# EAGLE design PicoBreakout (EAGLE 9.6.2)
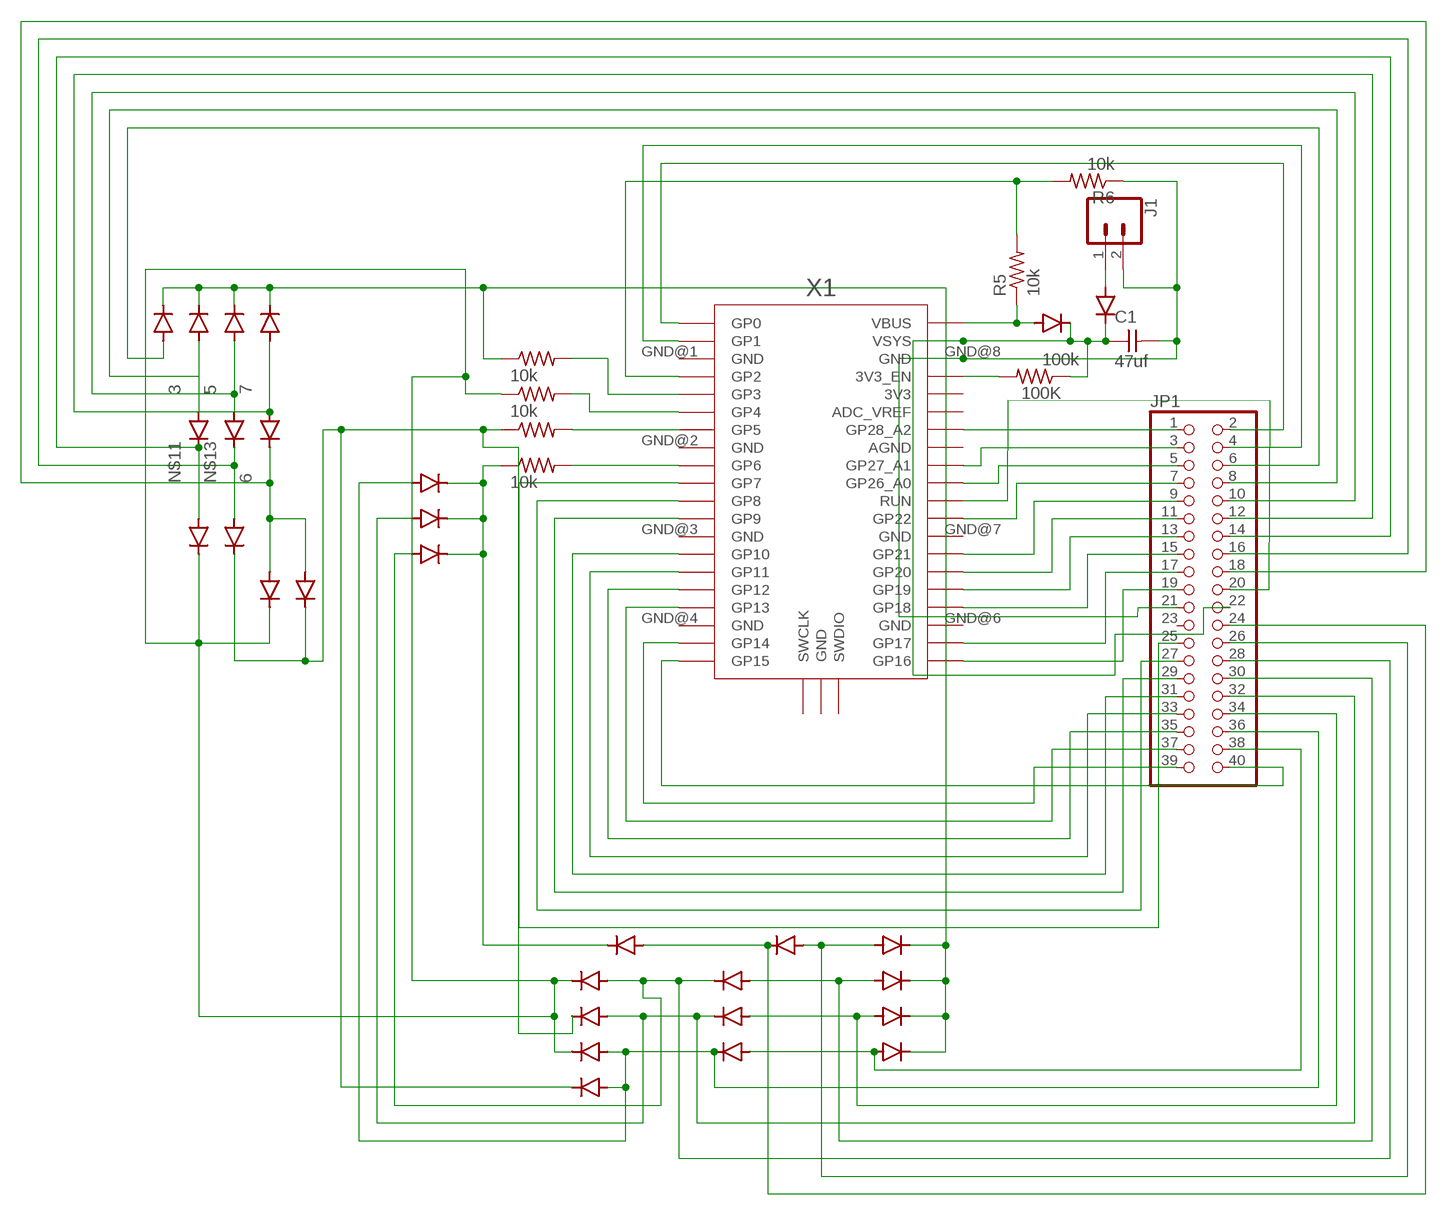
[diagram p0: schematic, sheet 1]

## Parts
100K  100k  R1206FAB  [R1206FAB]
C1  47uf  CAP_UNPOLARIZEDFAB  [C1206FAB]
D1  SCHOTTKY  DIODE_SCHOTTKY_CDBM1100-G  [MINI-SMA]
D2  SCHOTTKY  DIODE_SCHOTTKY_CDBM1100-G  [MINI-SMA]
D3  SCHOTTKY  DIODE_SCHOTTKY_CDBM1100-G  [MINI-SMA]
D4  SCHOTTKY  DIODE_SCHOTTKY_CDBM1100-G  [MINI-SMA]
D5  SCHOTTKY  DIODE_SCHOTTKY_CDBM1100-G  [MINI-SMA]
D6  SCHOTTKY  DIODE_SCHOTTKY_CDBM1100-G  [MINI-SMA]
D7  SCHOTTKY  DIODE_SCHOTTKY_CDBM1100-G  [MINI-SMA]
D8  SCHOTTKY  DIODE_SCHOTTKY_CDBM1100-G  [MINI-SMA]
D9  SCHOTTKY  DIODE_SCHOTTKY_CDBM1100-G  [MINI-SMA]
D10  SCHOTTKY  DIODE_SCHOTTKY_CDBM1100-G  [MINI-SMA]
D11  SCHOTTKY  DIODE_SCHOTTKY_CDBM1100-G  [MINI-SMA]
D12  SCHOTTKY  DIODE_SCHOTTKY_CDBM1100-G  [MINI-SMA]
D13  SCHOTTKY  DIODE_SCHOTTKY_CDBM1100-G  [MINI-SMA]
D14  SCHOTTKY  DIODE_SCHOTTKY_CDBM1100-G  [MINI-SMA]
D15  SCHOTTKY  DIODE_SCHOTTKY_CDBM1100-G  [MINI-SMA]
D16  SCHOTTKY  DIODE_SCHOTTKY_CDBM1100-G  [MINI-SMA]
D17  SCHOTTKY  DIODE_SCHOTTKY_CDBM1100-G  [MINI-SMA]
D18  SCHOTTKY  DIODE_SCHOTTKY_CDBM1100-G  [MINI-SMA]
D19  SCHOTTKY  DIODE_SCHOTTKY_CDBM1100-G  [MINI-SMA]
D20  SCHOTTKY  DIODE_SCHOTTKY_CDBM1100-G  [MINI-SMA]
D21  SCHOTTKY  DIODE_SCHOTTKY_CDBM1100-G  [MINI-SMA]
D22  SCHOTTKY  DIODE_SCHOTTKY_CDBM1100-G  [MINI-SMA]
D23  SCHOTTKY  DIODE_SCHOTTKY_CDBM1100-G  [MINI-SMA]
D24  SCHOTTKY  DIODE_SCHOTTKY_CDBM1100-G  [MINI-SMA]
D25  SCHOTTKY  DIODE_SCHOTTKY_CDBM1100-G  [MINI-SMA]
D26  SCHOTTKY  DIODE_SCHOTTKY_CDBM1100-G  [MINI-SMA]
D27  SCHOTTKY  DIODE_SCHOTTKY_CDBM1100-G  [MINI-SMA]
D28  SCHOTTKY  DIODE_SCHOTTKY_CDBM1100-G  [MINI-SMA]
D29  SCHOTTKY  DIODE_SCHOTTKY_CDBM1100-G  [MINI-SMA]
J1  CONN_02LOCK_LONGPADS  [1X02_LOCK_LONGPADS]
JP1  PINHD-2X20  [2X20]
R1  10k  R1206FAB  [R1206FAB]
R2  10k  R1206FAB  [R1206FAB]
R3  10k  R1206FAB  [R1206FAB]
R4  10k  R1206FAB  [R1206FAB]
R5  10k  R1206FAB  [R1206FAB]
R6  10k  R1206FAB  [R1206FAB]
X1  RPI_PICO_IG-TH  [RPI_PICO_TH]

## Nets
1: D1.KATHODE D2.KATHODE D3.KATHODE D13.KATHODE D14.KATHODE D15.KATHODE D16.KATHODE D24.KATHODE R1.1
3: D1.ANODE D4.ANODE JP1.8
4: D7.KATHODE D17.KATHODE D18.KATHODE D25.KATHODE R2.1
5: D2.ANODE D5.ANODE JP1.10
6: D6.KATHODE D7.ANODE D8.ANODE JP1.18
7: D3.ANODE D6.ANODE JP1.12
8: D21.KATHODE D22.KATHODE D23.KATHODE D26.KATHODE R4.1
9: D9.ANODE D13.ANODE JP1.26
10: D10.KATHODE D17.ANODE D23.ANODE JP1.28
11: D10.ANODE D14.ANODE JP1.30
12: D11.KATHODE D19.ANODE D22.ANODE JP1.32
13: D11.ANODE D15.ANODE JP1.34
14: D12.KATHODE D18.ANODE D20.ANODE D21.ANODE JP1.36
15: D12.ANODE D16.ANODE JP1.38
N$1: R1.2 X1.GP3
N$2: R2.2 X1.GP4
N$3: R3.2 X1.GP5
N$4: R4.2 X1.GP6
N$6: D8.KATHODE D19.KATHODE D20.KATHODE D27.KATHODE R3.1
N$10: D24.ANODE JP1.6
N$11: D4.KATHODE D25.ANODE JP1.14
N$12: D9.KATHODE D26.ANODE JP1.24
N$13: D5.KATHODE D27.ANODE JP1.16
N$18: D28.ANODE J1.1
N$19: C1.2 J1.2 JP1.21 R6.1 X1.GND@8(GND)
N$20: 100K.1 C1.1 D28.KATHODE D29.KATHODE JP1.22 X1.VSYS
N$22: R5.2 R6.2 X1.GP2
N$23: JP1.1 X1.GP28_A2
N$24: 100K.2 X1.3V3_EN
N$25: JP1.3 X1.GP27_A1
N$26: JP1.5 X1.GP26_A0
N$27: JP1.7 X1.GP22
N$28: JP1.9 X1.GP21
N$29: JP1.11 X1.GP20
N$30: JP1.13 X1.GP19
N$31: JP1.15 X1.GP18
N$32: JP1.17 X1.GP17
N$33: JP1.19 X1.GP16
N$34: JP1.40 X1.GP15
N$35: JP1.39 X1.GP14
N$37: JP1.35 X1.GP12
N$38: JP1.33 X1.GP11
N$39: JP1.31 X1.GP10
N$40: JP1.29 X1.GP9
N$41: JP1.27 X1.GP8
N$42: JP1.25 X1.GP7
N$43: JP1.2 X1.GP0
N$44: JP1.4 X1.GP1
N$48: JP1.37 X1.GP13
N$64: JP1.20 X1.RUN
N$65: D29.ANODE R5.1 X1.VBUS
Unconnected: JP1.23 X1.3V3 X1.ADC_VREF X1.AGND X1.GND@1(GND) X1.GND@2(GND) X1.GND@3(GND) X1.GND@4(GND) X1.GND@5(GND) X1.GND@6(GND) X1.GND@7(GND) X1.SWCLK X1.SWDIO

## Library data of the parts
100K R1-R6 = eagle_fab:R: Resistor (US Symbol) Variants with postfix FAB are widened to allow the routing of internal traces
C1 = eagle_fab:CAP_UNPOLARIZED
D1-D29 = eagle_fab:DIODE_SCHOTTKY_CDBM1100-G: Diode schottky 100V 1A mini-SMA as found in the fablab inventory Reverse Voltage: 100 Volts Forward Current: 1.0 Amp Maximum forward voltage: 0.85 Volts Made by Zaerc.
J1 = SparkFun-Connectors:CONN_02: Multi connection point. Often used as Generic Header-pin footprint for 0.1 inch spaced/style header connections On any of the 0.1 inch spaced packages, you can populate with these: Break Away Headers - Straight <https://www.sparkfun.com/products/116> (PRT-00116) Break Away Male Headers - Right Angle <https://www.sparkfun.com/products/553> (PRT-00553) Female Headers <https://www.sparkfun.com/products/115> (PRT-00115) Break Away Headers - Machine Pin <https://www.sparkfun.com/products/117> (PRT-00117) Break Away Female Headers - Swiss Machine Pin <https://www.sparkfun.com/products/743> (PRT-00743) For SCREWTERMINALS and SPRING TERMINALS visit here: Screw Terimnals on SparkFun.com <https://www.sparkfun.com/search/results?term=Screw+Terminals> (5mm/3.5mm/2.54mm spacing) This device is also useful as a general connection point to wire up your design to another part of your project. Our various solder wires solder well into these plated through hole pads. Hook-Up Wire - Assortment (Stranded, 22 AWG) <https://www.sparkfun.com/products/11375> (PRT-11375) Hook-Up Wire - Assortment (Solid Core, 22 AWG) <https://www.sparkfun.com/products/11367> (PRT-11367) View the entire wire category on our website here <https://www.sparkfun.com/categories/141> Special notes: Molex polarized connector foot print use with: PRT-08233 with associated crimp pins and housings. 2.54_SCREWTERM for use with PRT-10571. 3.5mm Screw Terminal footprints for PRT-08084 5mm Screw Terminal footprints for use with PRT-08432
JP1 = adafruit:PINHD-2X20: PIN HEADER
X1 = RaspberryPi_Pico:RPI_PICO_IG

## Board
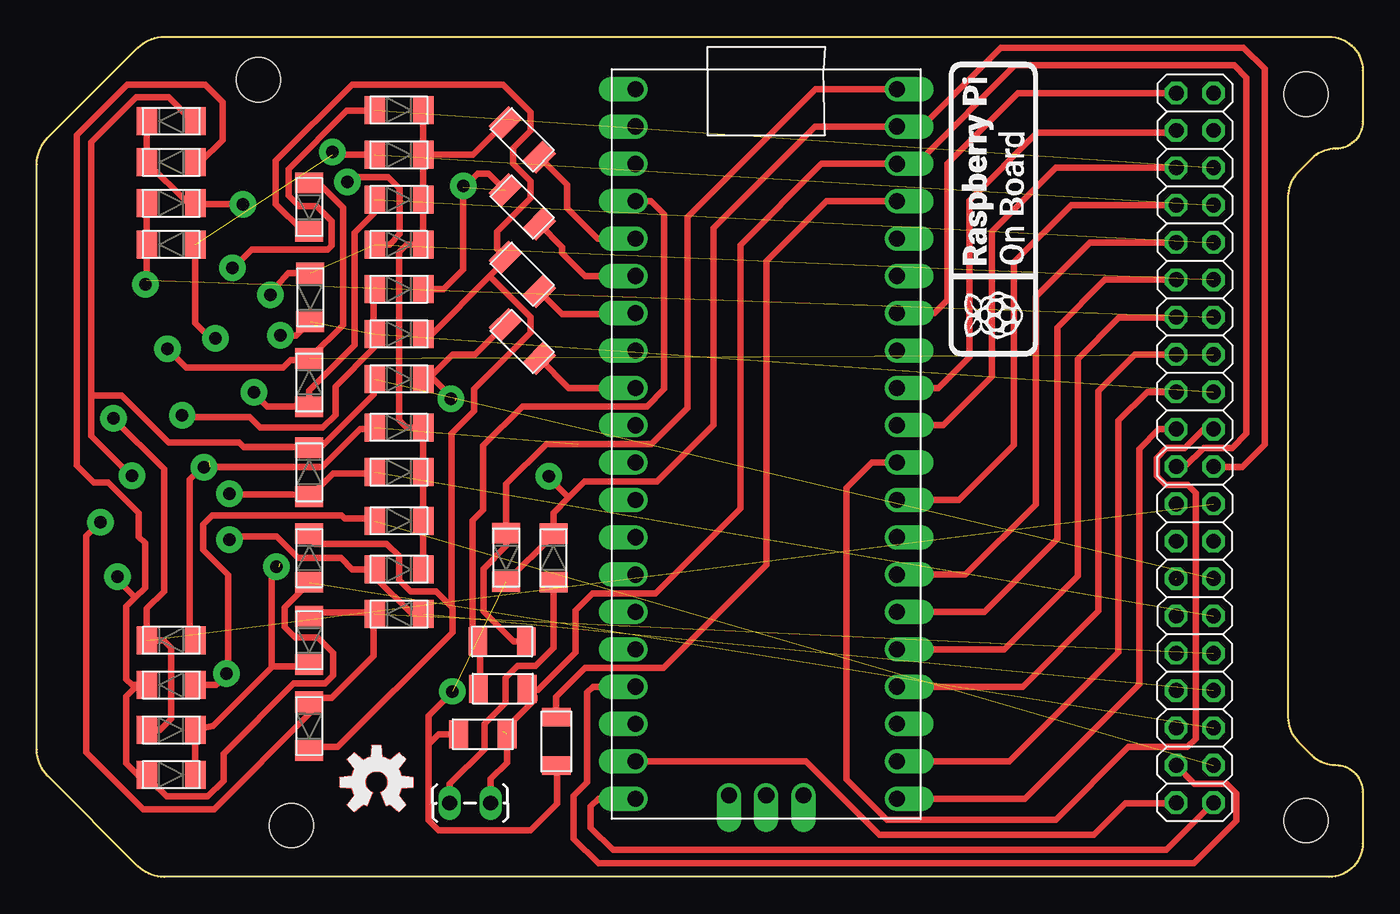
[diagram p1: board, top side]
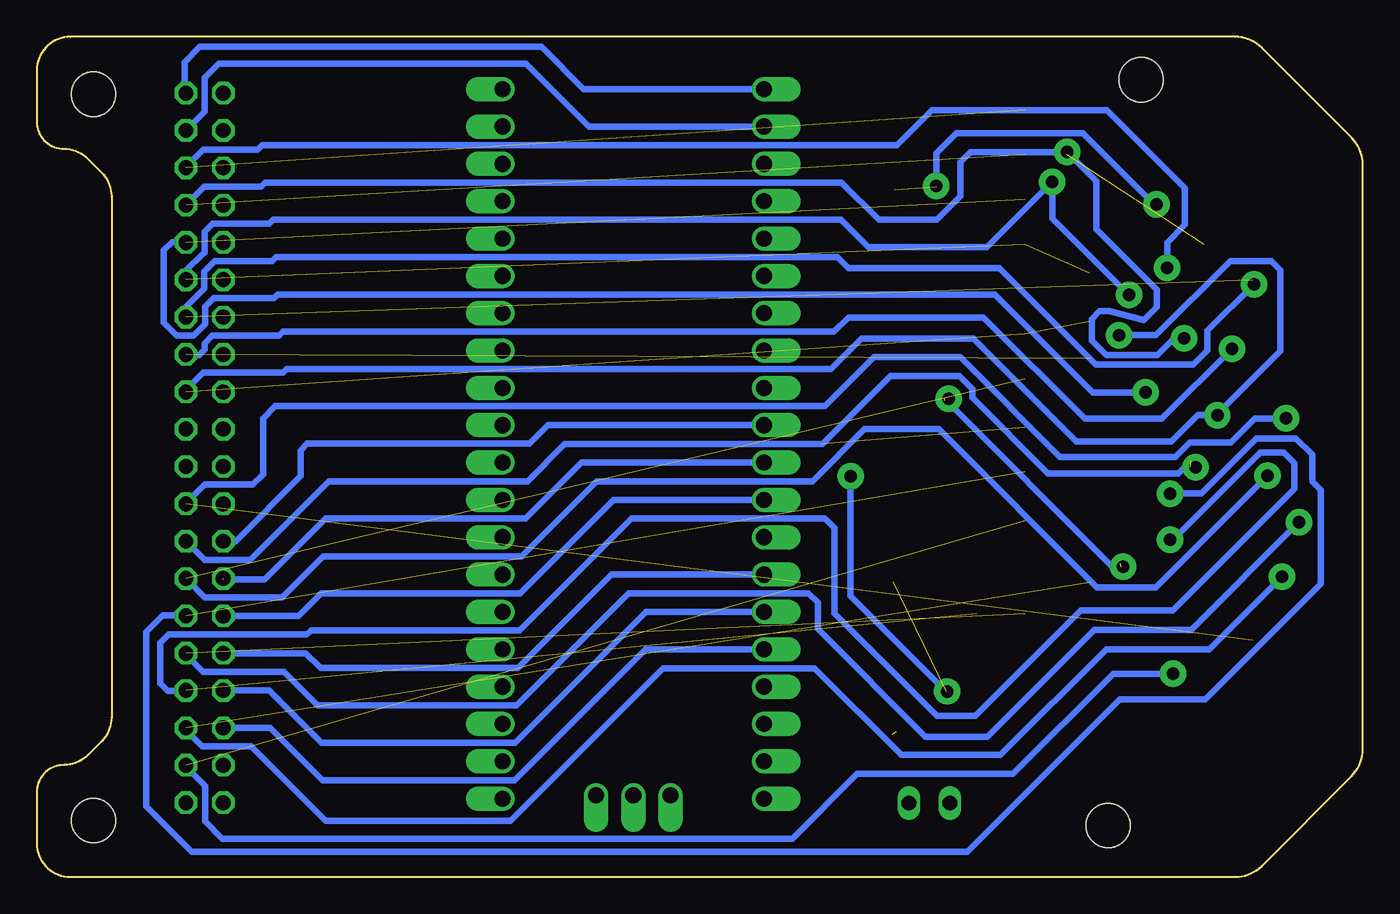
[diagram p2: board, bottom side, seen from below]

Size 90.17 x 57.15 mm. Coordinates in mm from the lower left corner, seen from the top.
Outline: 87.88,0 8.67,0 arc-45 6.88,0.74 0.74,6.88 arc-45 0,8.67 0,48.48 arc-45 0.74,50.27 6.88,56.41 arc-45 8.67,57.15 87.88,57.15 arc-90 90.17,54.86 90.17,51.38 arc-90 88.32,49.53 arc45 86.71,48.86 85.76,47.91 arc45 85.09,46.3 85.09,10.85 arc45 85.76,9.24 86.71,8.29 arc45 88.32,7.62 arc-90 90.17,5.77 90.17,2.29 arc-90 87.88,0
Copper layers (1*16): Top 0.035mm / dielectric 1.5mm / Bottom 0.035mm
Design rules "OthermillDRC_30_deg_v2": minimum track width 6mil, minimum drill 0.8mm, track to track 6mil, track to pad 6mil, pad to pad 6mil, via to via 6mil, smd to smd 0mil, copper to edge 0mil, drill to drill 6mil, minimum pad ring 10mil, minimum via ring 10mil, stop-mask expansion 1mil, vias tented up to drill 30mil, thermal gap 6mil
Holes 3 mm at 15.07,54.23 17.31,3.51 86.32,53.24 86.32,3.85

### Footprints (pad centres in the part's own frame; a part is rotated, then mirrored left to right if it is on the bottom)
R1206FAB = smd 1.27 x 1.905: 1 -1.651,0; 2 1.651,0
C1206FAB = smd 1.27 x 1.905: 1 -1.651,0; 2 1.651,0
MINI-SMA = smd 1.4 x 1.9: ANODE 1.65,0; KATHODE -1.65,0
1X02_LOCK_LONGPADS = drill 1.016 long: 1 -0.127,0; 2 2.667,0
2X20 = drill 1.016 octagon: 1 -24.13,-1.27; 2 -24.13,1.27; 3 -21.59,-1.27; 4 -21.59,1.27; 5 -19.05,-1.27; 6 -19.05,1.27; 7 -16.51,-1.27; 8 -16.51,1.27; 9 -13.97,-1.27; 10 -13.97,1.27; 11 -11.43,-1.27; 12 -11.43,1.27; 13 -8.89,-1.27; 14 -8.89,1.27; 15 -6.35,-1.27; 16 -6.35,1.27; 17 -3.81,-1.27; 18 -3.81,1.27; 19 -1.27,-1.27; 20 -1.27,1.27; 21 1.27,-1.27; 22 1.27,1.27; 23 3.81,-1.27; 24 3.81,1.27; 25 6.35,-1.27; 26 6.35,1.27; 27 8.89,-1.27; 28 8.89,1.27; 29 11.43,-1.27; 30 11.43,1.27; 31 13.97,-1.27; 32 13.97,1.27; 33 16.51,-1.27; 34 16.51,1.27; 35 19.05,-1.27; 36 19.05,1.27; 37 21.59,-1.27; 38 21.59,1.27; 39 24.13,-1.27; 40 24.13,1.27
RPI_PICO_TH = drill 1.1 pad 1.6 offset: 3V3 8.89,13.97; 3V3_EN 8.89,16.51; ADC_VREF 8.89,11.43; AGND 8.89,6.35; GND@1 -8.89,19.05; GND@2 -8.89,6.35; GND@3 -8.89,-6.35; GND@4 -8.89,-19.05; GND@5 0,-23.9; GND@6 8.89,-19.05; GND@7 8.89,-6.35; GND@8 8.89,19.05; GP0 -8.89,24.13; GP1 -8.89,21.59; GP2 -8.89,16.51; GP3 -8.89,13.97; GP4 -8.89,11.43; GP5 -8.89,8.89; GP6 -8.89,3.81; GP7 -8.89,1.27; GP8 -8.89,-1.27; GP9 -8.89,-3.81; GP10 -8.89,-8.89; GP11 -8.89,-11.43; GP12 -8.89,-13.97; GP13 -8.89,-16.51; GP14 -8.89,-21.59; GP15 -8.89,-24.13; GP16 8.89,-24.13; GP17 8.89,-21.59; GP18 8.89,-16.51; GP19 8.89,-13.97; GP20 8.89,-11.43; GP21 8.89,-8.89; GP22 8.89,-3.81; GP26_A0 8.89,1.27; GP27_A1 8.89,3.81; GP28_A2 8.89,8.89; RUN 8.89,-1.27; SWCLK -2.54,-23.9; SWDIO 2.54,-23.9; VBUS 8.89,24.13; VSYS 8.89,21.59

### Placement (x,y rotation side)
100K  35.33,9.22 90 top
C1  30.33,9.71 0 top
D1  24.63,49.12 180 top
D2  24.63,46.07 180 top
D3  24.63,43.03 180 top
D4  9.14,43.03 0 top
D5  18.54,33.63 270 top
D6  18.59,39.42 90 top
D7  24.63,39.98 180 top
D8  24.63,36.93 180 top
D9  9.14,16.1 0 top
D10  18.54,27.53 270 top
D11  24.63,17.88 0 top
D12  9.14,13.05 0 top
D13  24.63,30.58 180 top
D14  24.63,27.53 180 top
D15  24.63,20.93 180 top
D16  24.63,24.23 180 top
D17  9.14,51.41 0 top
D18  9.14,48.61 0 top
D19  18.54,10.26 90 top
D20  18.54,21.69 270 top
D21  9.14,6.96 180 top
D22  18.54,16.1 90 top
D23  24.63,33.88 180 top
D24  24.63,52.17 180 top
D25  9.14,45.82 180 top
D26  9.14,10.01 180 top
D27  18.54,45.57 90 top
D28  35.13,21.7 270 top
D29  31.93,21.72 90 top
J1  28.2,5.03 0 top
JP1  78.76,29.19 270 top
R1  33.02,50.14 315 top
R2  33.02,45.57 315 top
R3  33.02,40.99 315 top
R4  33.02,36.42 315 top
R5  31.65,16.02 180 top
R6  31.69,12.81 180 top
U$2  [OSHW-LOGO-M_COPPER]  23.11,6.45 0 top
U$3  [RASPI_ON_BOARD_LOGO_20MM]  65.06,45.41 90 top
U$4  [OSHW-LOGO-M]  23.11,6.45 0 top
X1  49.61,29.46 0 top

### Tracks (layer width: path | path; a pad name or v marks a point on that pad's centre or on a via)
1
  Top 0.457: D1.KATHODE D2.KATHODE D3.KATHODE 25.14,43.03 24.63,42.52 24.63,31.09 25.14,30.58 D13.KATHODE D14.KATHODE D16.KATHODE D15.KATHODE | R1.1 29.66,49.12 D1.KATHODE | D24.KATHODE D1.KATHODE
3  (2 unrouted)
  Top 0.457: 12.24,36.24 10.79,37.68 D4.ANODE | D1.ANODE 20.11,49.12
4  (2 unrouted)
  Top 0.457: D17.KATHODE D18.KATHODE 10.28,45.82 D25.KATHODE 10.84,45.77 14.27,45.77 | D7.KATHODE 27.68,39.98 29,41.3 29,46.94 29.2,46.94 29.2,47.09 29.97,47.85 30.73,47.85 R2.1
  Bottom 0.457: 14.27,45.77 14.27,45.82 19.05,50.59 27.63,50.59 29,49.22 29,46.94
5  (1 unrouted)
  Top 0.457: D5.ANODE 18.5,32.02 15.68,32.02 14.79,32.91 | D2.ANODE 22.91,46.02 22.91,45.11 21.63,43.83 21.63,36.17 18.54,33.07 D5.ANODE | 17.57,32.02 D5.ANODE
6  (2 unrouted)
  Top 0.457: D7.ANODE 22.91,39.93 22.91,37.18 D8.ANODE 22.91,36.88 22.91,35.97 20.31,33.37 20.31,31.43 19.45,30.57 15.2,30.57 14.49,31.27 10.19,31.27 9.93,31.54 | D6.KATHODE 18.57,37.77 17.62,36.83 16.86,36.83
7  (2 unrouted)
  Top 0.457: D6.ANODE 17.08,41.07 16.3,40.2 16.3,39.62 | D3.ANODE 24,43.03 24.68,43.71 24.68,46.82 23.9,47.6 21.33,47.6
8  (2 unrouted)
  Top 0.457: D21.KATHODE D26.KATHODE 12,10.27 16.05,14.32 | R4.1 29.79,35.53 28.27,35.53 26.62,33.88 D23.KATHODE 26.99,33.88 28.46,32.41 | 16.05,14.32 15.97,14.32 15.97,20.8 16.5,21.33 | 16.05,14.32 18.33,14.32 D22.KATHODE
  Bottom 0.457: 28.49,32.56 17.02,21.09 16.45,21.09
9  (2 unrouted)
  Top 0.457: D9.ANODE 10.41,16.48 10.41,27.02 11.68,28.29 | 11.77,27.9 19.42,27.9 21.99,30.48 22.91,30.48 D13.ANODE
  Bottom 0.457: JP1.26 78.76,21.58 75.65,21.58 70.31,26.92 56.81,26.92 54.27,29.45 36.82,29.45
10  (1 unrouted)
  Top 0.457: D23.ANODE 22.91,33.83 22.91,32.81 19.28,29.18 D10.KATHODE 18.33,29.26 14.07,29.26 13.76,29.56 8.99,29.56 5.79,32.76 3.7,32.76 | 3.7,32.76 3.7,29.99 5.97,27.72 | 3.7,32.76 3.7,49.98 6.75,53.03 8.96,53.03 10.48,51.51 10.71,51.51 D17.ANODE
11  (1 unrouted)
  Top 0.457: 13.37,26.02 17.35,26.02 D10.ANODE 18.64,25.91 20.16,27.43 22.91,27.43 D14.ANODE
12  (1 unrouted)
  Top 0.457: D22.ANODE 18.64,17.98 22.91,17.98 D11.KATHODE 22.91,17.68 22.91,15.04 20.06,12.19 18.64,12.19 D19.ANODE 18.59,11.86 18.59,11.15 12.06,4.62 7.22,4.62 3.36,8.48 3.36,23.18 4.23,24.05
13  (1 unrouted)
  Top 0.457: D11.ANODE 25.52,17.88 22.98,20.42 D15.ANODE 21.46,20.93 20.69,21.7 17.78,21.7 16.31,23.16 13.15,23.16
14  (1 unrouted)
  Top 0.457: D12.KATHODE 6.85,13.05 | 6.85,13.05 6.47,13.05 6.09,13.44 6.09,18.39 6.71,19 | 6.71,19 7.36,19.66 7.36,22.71 6.95,23.12 6.95,24.75 4.86,26.84 3.88,26.84 2.73,27.99 2.73,50.47 6.16,53.9 11.44,53.9 12.64,52.7 12.64,50.13 11.12,48.61 D18.ANODE | 6.85,13.05 6.09,12.29 6.09,7.72 6.85,6.96 D21.ANODE 7.82,6.49 8.82,5.49 11.63,5.49 12.7,6.55 12.7,8.38 17.48,13.17 19.62,13.17 20.16,13.71 20.16,15.24 19.1,16.3 17.57,16.3 16.86,17.02 16.86,18.34 18.33,19.81 D20.ANODE | 6.71,19 5.6,20.11 5.6,20.37
15  (1 unrouted)
  Top 0.457: D12.ANODE 12.19,13.05 13.02,13.89 13.02,20.55 11.32,22.25 11.32,23.98 11.95,24.6 20.73,24.6 20.95,24.38 22.91,24.38 D16.ANODE
N$1
  Top 0.457: R1.2 36.07,47.08 36.07,45.51 38.15,43.43 X1.GP3
N$2
  Top 0.457: R2.2 35.74,42.84 35.74,42.43 37.28,40.89 X1.GP4
N$3
  Top 0.457: 34.18,40.08 R3.2 35.71,38.3 40.66,38.3 X1.GP5
N$4
  Top 0.457: 34.18,35.76 R4.2 36.17,33.27 X1.GP6
N$5  (via drill 0.85 pad 1.8)
  other vias: 16.31,21.11
N$6
  Top 0.457: D8.KATHODE 26.87,36.93 30.81,40.87 | 30.81,40.87 31.85,41.91 R3.1 31.29,42.72 31.29,43.89 33.57,46.17 33.57,47.33 32.39,48.51 32.39,49.56 33.57,50.75 33.57,52.02 31.7,53.9 21.43,53.9 16.25,48.72 16.25,45.77 18.11,43.92 D27.KATHODE | 28.2,18.38 27.17,19.41 25.44,19.41 24.63,20.22 24.63,21.83 23.8,22.66 18.93,22.66 D20.KATHODE | 28.2,18.38 28.28,18.31 28.28,16.65 20.46,8.84 18.64,8.84 D19.KATHODE | 30.81,40.87 30.83,40.84 33.57,38.1 33.57,37.03 29.74,33.2 29.74,31.7 28.2,30.15 28.2,18.38
N$7  (via drill 0.85 pad 1.8)
  other vias: 28.16,32.51
N$8  (via drill 0.85 pad 1.8)
  other vias: 14.02,45.75
N$9  (via drill 0.85 pad 1.8)
  Bottom 0.457: v20.12,49.3 26.67,49.3 27.35,48.62 27.35,46.29 28.94,44.7 32.9,44.7 35.43,47.23 74.62,47.23 74.89,46.96 78.78,46.96 80,45.74
N$10  (1 unrouted)
  Top 0.457: 13.34,41.38 14.62,42.67 19.78,42.67 20.07,42.96 20.07,44.59 19.05,45.62 17.83,45.62 17.11,46.33 17.11,48.16 21.08,52.12 22.91,52.12 D24.ANODE
N$11  (1 unrouted)
  Top 0.457: 7.49,40.61 D4.KATHODE D25.ANODE
N$12  (1 unrouted)
  Top 0.457: 5.21,31.19 8.65,27.75 8.65,19.43 7.49,18.26 D9.KATHODE 8.63,16.1 9.14,15.59 9.14,10.77 8.38,10.01 D26.ANODE
N$13  (1 unrouted)
  Top 0.457: 8.88,35.91 10.15,34.64 16.76,34.64 17.27,35.15 18.41,35.15 D5.KATHODE 18.64,35.35 20.83,37.54 20.83,45.51 19.12,47.22 D27.ANODE
N$14  (via drill 0.85 pad 1.8)
  other vias: 29.01,47.02
N$15  (via drill 0.85 pad 1.8)
  Bottom 0.457: v21.13,47.27 25.56,42.84 33.6,42.84 35.47,44.7 74.08,44.7 74.35,44.44 78.22,44.44 78.75,43.9 78.75,42.47
N$16  (via drill 0.85 pad 1.8)
  Bottom 0.457: v15.89,39.58 21.09,44.79 21.09,47.34
N$17  (via drill 0.85 pad 1.8)
  Bottom 0.457: v16.56,36.86 14.07,36.86 9.02,41.91 6.24,41.91 5.6,41.27 5.6,35.78 9.88,31.49
N$18
  Top 0.457: D28.ANODE 35.13,15.57 33.93,14.38 32.71,14.38 31.86,13.53 31.86,11.83 30.44,10.41 30.44,8.69 28.07,6.32 J1.1
N$19  (1 unrouted)
  Top 0.457: R6.1 33.85,12.3 33.85,12.06 31.7,9.91 | 31.98,10.1 C1.2 31.98,7.78 30.87,6.67 J1.2 | R6.1 33.34,13.14 | R6.1 33.42,12.73 34.09,12.73 36.63,15.27 36.63,18.14 37.79,19.3 42.08,19.3 47.85,25.07 47.85,42.99 53.37,48.51 X1.GND@8 58.74,48.75 60.08,48.75 66.53,55.2 81.44,55.2 82.27,54.38 82.27,30.15 81.3,29.19 79.35,29.19 78.08,27.92 JP1.21
N$20  (1 unrouted)
  Top 0.457: D29.KATHODE 35.13,23.28 D28.KATHODE 35.13,24.77 36.17,25.82 | 26.66,9.03 26.66,3.86 27.34,3.18 33.59,3.18 35.38,4.97 35.38,7.51 100K.1 | C1.1 27.34,9.71 26.66,9.03 | 36.17,25.82 37.24,26.89 42.16,26.89 46.01,30.73 46.01,44.15 52.91,51.05 X1.VSYS 60.2,51.05 65.57,56.42 82.04,56.42 83.5,54.96 83.5,29.4 82,27.9 80.04,27.9 JP1.22 | 36.17,25.82 34.94,27.05 | 26.66,9.03 26.66,10.97 28.32,12.63
N$22
  Top 0.457: R6.2 30.15,12.92 30.15,16.54 30,16.7 | R5.2 30,16.7 | 30,16.7 29.63,17.06 29.63,24.25 30.35,24.98 30.35,29.34 33.02,32.01 41.49,32.01 42.67,33.19 42.67,45.08 41.77,45.97 X1.GP2
N$23
  Top 0.457: X1.GP28_A2 61.04,38.35 61.94,39.24 61.94,48.53 66.72,53.32 JP1.1
N$24
  Top 0.457: 100K.2 35.33,12.24 37.3,14.21 42.61,14.21 49.63,21.22 49.63,41.89 53.71,45.97 X1.3V3_EN
N$25
  Top 0.457: X1.GP27_A1 61.31,33.27 63.42,35.37 63.42,46.01 68.02,50.61 77.32,50.61 JP1.3
N$26
  Top 0.457: JP1.5 69.3,48.24 64.94,43.88 64.94,34.02 61.65,30.73 X1.GP26_A0
N$27
  Top 0.457: X1.GP22 62.72,25.65 66.45,29.38 66.45,41.81 70.34,45.7 JP1.7
N$28
  Top 0.457: X1.GP21 63.14,20.57 67.93,25.35 67.93,39.48 71.61,43.16 JP1.9
N$29
  Top 0.457: X1.GP20 64.44,18.03 69.41,23 69.41,37.38 72.65,40.62 JP1.11
N$30
  Top 0.457: X1.GP19 65.79,15.49 70.78,20.48 70.78,35.24 73.58,38.04 77.44,38.04 JP1.13
N$31
  Top 0.457: X1.GP18 67.07,12.95 72.2,18.08 72.2,33.06 74.69,35.54 JP1.15
N$32
  Top 0.457: X1.GP17 66.13,7.87 73.56,15.29 73.56,31.05 75.51,33 JP1.17
N$33
  Top 0.457: X1.GP16 67.18,5.33 74.97,13.12 74.97,29.12 76.31,30.46 JP1.19
N$34
  Top 0.457: X1.GP15 38.21,5.33 37.67,4.79 37.67,3.36 39.18,1.85 76.82,1.85 JP1.40
N$35
  Top 0.457: JP1.39 77.44,5.01 74.01,5.01 71.88,2.88 57.29,2.88 52.3,7.87 X1.GP14
N$36  (via drill 0.85 pad 1.8)
  other vias: 28.26,12.63
N$37
  Bottom 0.457: X1.GP12 48.78,15.49 57.7,6.57 70.74,6.57 74.31,10.14 JP1.35
N$38
  Bottom 0.457: X1.GP11 48.73,18.03 57.65,9.11 70.81,9.11 74.38,12.68 JP1.33
N$39
  Bottom 0.457: X1.GP10 51.08,20.57 57.43,14.22 70.87,14.22 71.87,15.22 JP1.31
N$40
  Bottom 0.457: X1.GP9 50.94,25.65 57.3,19.29 70.83,19.29 72.36,17.76 JP1.29
N$41  (1 unrouted)
  Bottom 0.457: X1.GP8 53.13,28.19 56.94,24.38 70.51,24.38 74.66,20.23 77.45,20.23
N$42
  Bottom 0.457: X1.GP7 55.39,30.73 56.65,29.47 71.77,29.47 72.22,29.02 72.22,27.27 76.65,22.84 JP1.25
N$43
  Bottom 0.457: X1.GP0 52.98,53.59 55.85,56.46 79.09,56.46 80.12,55.42 80.12,53.41 JP1.2
N$44
  Bottom 0.457: X1.GP1 52.63,51.05 56.88,55.3 77.81,55.3 78.76,54.35 78.76,52.04 JP1.4
N$45  (via drill 0.85 pad 1.8)
  Bottom 0.457: v34.82,27.27 34.84,27.25 34.84,19.11 28.32,12.6
N$46  (via drill 0.85 pad 1.8)
  Bottom 0.457: v13.3,41.43 13.3,43.14 12.09,44.36 12.09,46.84 17.39,52.15 29.3,52.15 31.66,49.78 74.85,49.78 75.16,49.48 78.84,49.48 80.01,48.31
N$47
  Bottom 0.457: 20.08,49.3 18.12,47.34 18.12,44.12
N$48
  Top 0.457: X1.GP13 37.81,12.95 37.41,12.54 37.41,6.43 36.52,5.54 36.52,2.61 38.2,0.93 78.7,0.93 81.58,3.82 81.58,5.68 80.91,6.35 78.73,6.35 JP1.37
N$49  (via drill 0.85 pad 1.8)
  Bottom 0.457: v8.9,35.92 13.66,31.17 18.9,31.17 25.8,38.06 34.98,38.06 35.95,37.09 73.41,37.09 73.67,36.82 78.22,36.82 78.75,36.29 78.75,35.89 79.14,35.5 80.06,35.5
N$50  (via drill 0.85 pad 1.8)
  Bottom 0.457: v7.41,40.31 10.56,37.16 10.56,35.82 11.53,34.84 18.13,34.84 24.72,41.43 34.98,41.43 35.72,42.17 73.88,42.17 74.16,41.88 78.08,41.88 78.78,41.19 78.78,40.01 80.21,38.58
N$51
  Bottom 0.457: 78.8,42.46 80.1,41.17
N$52  (via drill 0.85 pad 1.8)
  Bottom 0.457: v9.89,31.42 11.22,31.42 13.01,29.63 19.48,29.63 26.47,36.63 34.08,36.63 36.15,34.55 73.16,34.55 73.41,34.3 78.86,34.3 79.98,33.18
N$53  (via drill 0.85 pad 1.8)
  Bottom 0.457: v5.21,31.2 7.34,31.2 8.98,29.55 11.77,29.55 12.74,28.58 20.6,28.58 27.37,35.35 33.24,35.35 36.58,32.02 73.97,32.02 74.79,31.2 74.79,27.41
N$54  (via drill 0.85 pad 1.8)
  Bottom 0.457: v4.35,24.14 11.67,16.82 18.25,16.82 25.54,9.54 29.73,9.54 37.06,16.87 37.06,18.66 37.69,19.29 49.93,19.29 57.53,11.69 71.07,11.69 73.35,13.97 78.85,13.97 80.09,15.21
N$55  (via drill 0.85 pad 1.8)
  Bottom 0.457: v6.46,27.3 14.07,19.69 18.07,19.69 28.83,30.46 33.87,30.46 37.43,26.91 52.12,26.91 57.2,21.82 70.69,21.82 73.47,19.03 78.75,19.03 79.98,20.26
N$56  (via drill 0.85 pad 1.8)
  Bottom 0.457: v11.35,27.86 12.13,27.86 12.55,27.45 21.4,27.45 26.54,32.6 26.54,33.18 27.44,34.07 32.12,34.07 36.73,29.46
N$57
  Bottom 0.457: 79.89,17.8 81.59,17.8 82.73,16.66 82.73,4.81 79.64,1.72 26.9,1.72 16.53,12.08 10.72,12.08 2.85,19.95 2.85,26.33 3.41,26.88
N$58  (via drill 0.85 pad 1.8)
  Bottom 0.457: v13.09,22.95 12.88,22.95 6.96,28.87 5.37,28.87 4.64,28.14 4.64,26.39 12.9,18.13 19.17,18.13 26.34,10.96 28.96,10.96 35.91,17.91 35.91,23.74 36.56,24.39 49.72,24.39 57.33,16.78 71.52,16.78 71.81,16.5 81.21,16.5 81.77,15.93 81.77,13.17 81.27,12.67 79.88,12.67
N$59  (via drill 0.85 pad 1.8)
  Bottom 0.457: v14.77,32.96 18.35,32.96 25.01,39.61 73.78,39.61 74.02,39.36 78.14,39.36 78.72,38.79 78.72,37.62 79.49,36.84 80.66,36.84 81.53,37.71 81.53,42.63 80.98,43.18 80.11,43.18
N$60  (via drill 0.85 pad 1.8)
  Bottom 0.457: v13.1,26.08 10.98,26.08 7.23,29.83 4.54,29.83 3.43,28.73 3.43,27.07
N$61  (via drill 0.85 pad 1.8)
  Bottom 0.457: v12.15,36.65 12.82,36.65 13.95,35.51 17.44,35.51 18.42,36.5 18.42,37.95 17.9,38.48 17.22,38.48 14.9,37.87 14.02,38.76 14.02,39.97 18.12,44.07 18.12,45.14
N$62  (via drill 0.85 pad 1.8)
  Bottom 0.457: v12.9,13.82 16.97,13.82 23.78,7.01 34.39,7.01 38.79,2.61 77.56,2.61 78.72,3.77 78.72,6.21 79.92,7.42
N$63  (via drill 0.85 pad 1.8)
  Bottom 0.457: v5.48,20.43 10.42,15.49 17.44,15.49 24.62,8.3 31.38,8.3 37.28,14.2 47.59,14.2 57.96,3.83 70.52,3.83 75.59,8.9 78.91,8.9 79.96,9.95
N$64
  Top 0.457: X1.RUN 56.81,28.19 55.07,26.45 55.07,6.65 57.82,3.9 69.29,3.9 74.25,8.86 78.25,8.86 78.81,9.41 78.81,26.12 78.28,26.65 76.78,26.65 76.16,27.27 76.16,28.51 76.81,29.17 78.07,29.17 79.36,30.46 JP1.20
N$65
  Top 0.457: R5.1 32.42,16.02 30.37,18.07 30.37,20.96 31.93,22.52 D29.ANODE 31.93,26.73 34.66,29.46 41.8,29.46 44.25,31.9 44.25,44.9 52.94,53.59 X1.VBUS
N$68
  Bottom 0.457: 79.97,25.47 78.76,26.68 75.49,26.68 74.79,27.39

### Text on the board
tValues: 100k | + | -